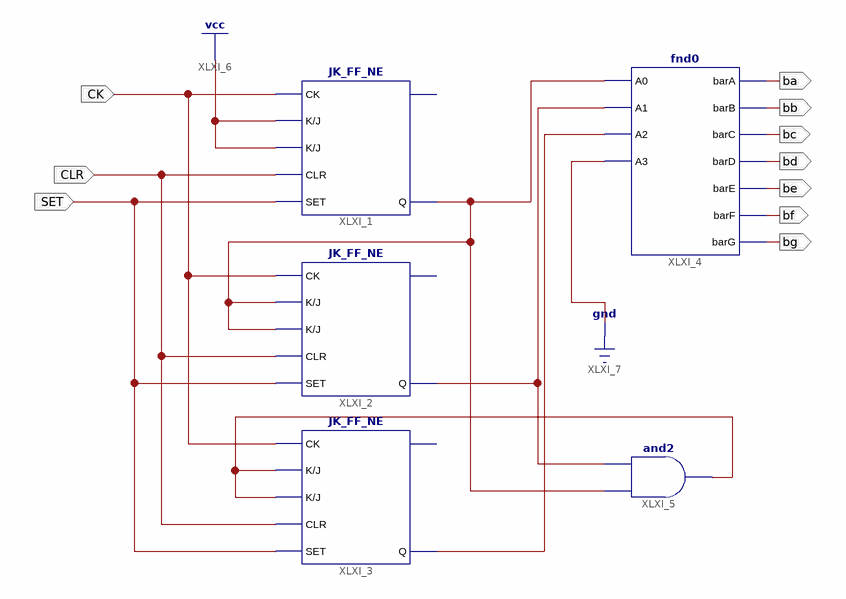
[diagram p0: schematic sheet 1]
// Xilinx ISE schematic Mod82.sch (spartan6) as structural Verilog: 5 symbols, 10 ports
module Mod82 (
  input  CK,
  input  CLR,
  input  SET,
  output ba,
  output bb,
  output bc,
  output bd,
  output be,
  output bf,
  output bg
);

  wire XLXN_1, XLXN_7, XLXN_8, XLXN_12;

  JK_FF_NE XLXI_1 (.CK(CK), .K(1'b1), .J(1'b1), .CLR(CLR), .SET(SET), .Q(XLXN_1));  // open: bQ
  JK_FF_NE XLXI_2 (.CK(CK), .K(XLXN_1), .J(XLXN_1), .CLR(CLR), .SET(SET), .Q(XLXN_7));  // open: bQ
  JK_FF_NE XLXI_3 (.CK(CK), .K(XLXN_12), .J(XLXN_12), .CLR(CLR), .SET(SET), .Q(XLXN_8));  // open: bQ
  fnd0 XLXI_4 (
    .A0(XLXN_1), .A1(XLXN_7), .A2(XLXN_8), .A3(1'b0), .barA(ba), .barB(bb), .barC(bc), .barD(bd), .barE(be),
    .barF(bf), .barG(bg));
  and XLXI_5 (XLXN_12, XLXN_1, XLXN_7);
endmodule
